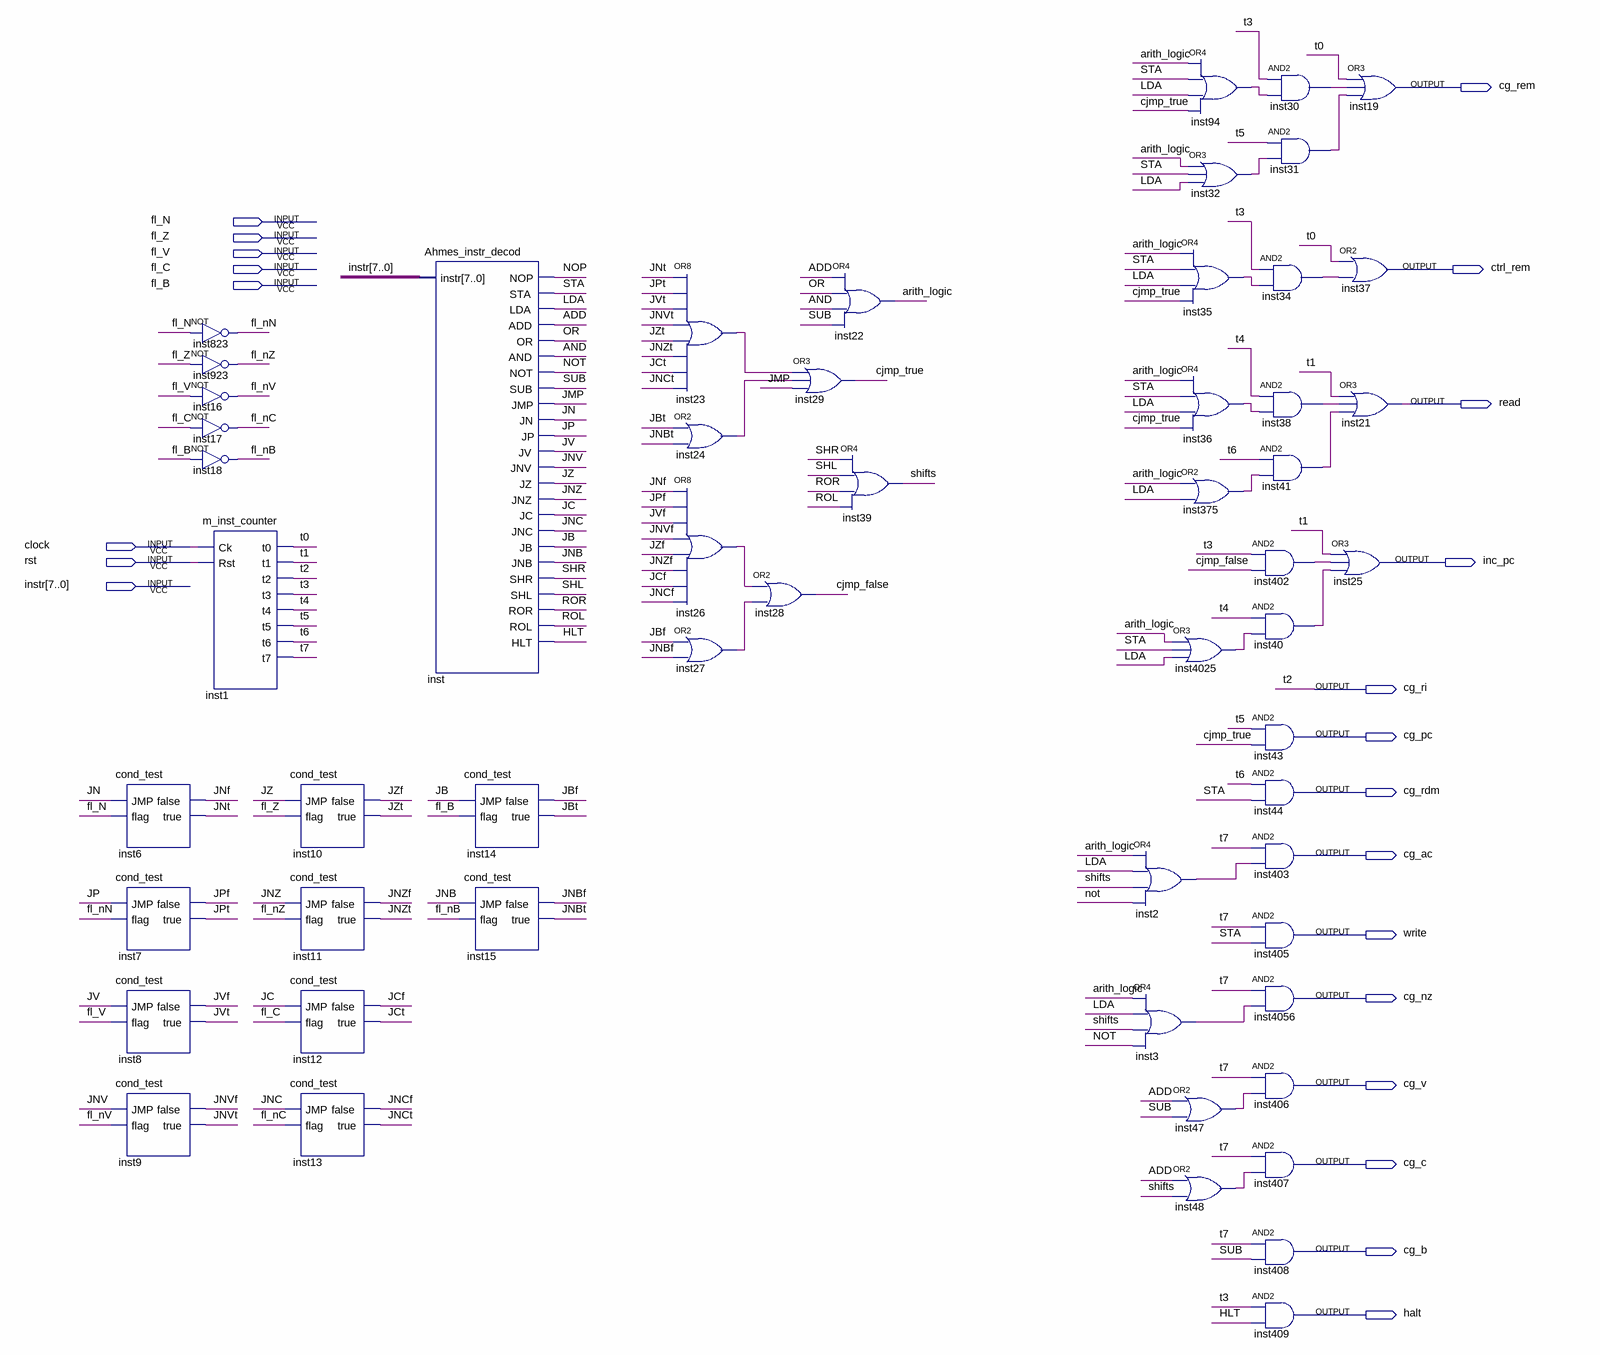
[diagram p0: schematic sheet]
// Quartus schematic Ahmes_uc.bdf as structural Verilog: 55 symbols, 22 pins
module Ahmes_uc (
  input  fl_N,
  input  fl_Z,
  input  fl_V,
  input  fl_C,
  input  fl_B,
  input  clock,
  input  rst,
  input  [7:0] instr,
  output cg_rem,
  output ctrl_rem,
  output read,
  output inc_pc,
  output cg_ri,
  output cg_pc,
  output cg_rdm,
  output cg_ac,
  output write,
  output cg_nz,
  output cg_v,
  output cg_c,
  output cg_b,
  output halt
);

  wire ADD, AND, arith_logic, cjmp_false, cjmp_true, fl_nB, fl_nC, fl_nN, fl_nV, fl_nZ, HLT, inst2_out,
       inst3_out, inst23_out, inst24_out, inst26_out, inst27_out, inst30_out, inst31_out, inst32_out,
       inst34_out, inst35_out, inst36_out, inst38_out, inst40_out, inst41_out, inst47_out, inst48_out,
       inst94_out, inst375_out, inst402_out, inst4025_out, JB, JBf, JBt, JC, JCf, JCt, JMP, JN, JNB, JNBf,
       JNBt, JNC, JNCf, JNCt, JNf, JNt, JNV, JNVf, JNVt, JNZ, JNZf, JNZt, JP, JPf, JPt, JV, JVf, JVt, JZ,
       JZf, JZt, LDA, NOP, NOT, OR, ROL, ROR, shifts, SHL, SHR, STA, SUB, t0, t1, t3, t4, t5, t6, t7;

  cond_test inst6 (.JMP(JN), .flag(fl_N), .false(JNf), .true(JNt));
  cond_test inst7 (.JMP(JP), .flag(fl_nN), .false(JPf), .true(JPt));
  cond_test inst8 (.JMP(JV), .flag(fl_V), .false(JVf), .true(JVt));
  cond_test inst9 (.JMP(JNV), .flag(fl_nV), .false(JNVf), .true(JNVt));
  not inst823 (fl_nN, fl_N);
  not inst923 (fl_nZ, fl_Z);
  not inst16 (fl_nV, fl_V);
  not inst17 (fl_nC, fl_C);
  not inst18 (fl_nB, fl_B);
  m_inst_counter inst1 (
    .Ck(clock), .Rst(rst), .t0(t0), .t1(t1), .t2(cg_ri), .t3(t3), .t4(t4), .t5(t5), .t6(t6), .t7(t7));
  cond_test inst10 (.JMP(JZ), .flag(fl_Z), .false(JZf), .true(JZt));
  cond_test inst11 (.JMP(JNZ), .flag(fl_nZ), .false(JNZf), .true(JNZt));
  cond_test inst12 (.JMP(JC), .flag(fl_C), .false(JCf), .true(JCt));
  cond_test inst13 (.JMP(JNC), .flag(fl_nC), .false(JNCf), .true(JNCt));
  Ahmes_instr_decod inst (
    .instr(instr), .NOP(NOP), .STA(STA), .LDA(LDA), .ADD(ADD), .OR(OR), .AND(AND), .NOT(NOT), .SUB(SUB),
    .JMP(JMP), .JN(JN), .JP(JP), .JV(JV), .JNV(JNV), .JZ(JZ), .JNZ(JNZ), .JC(JC), .JNC(JNC), .JB(JB),
    .JNB(JNB), .SHR(SHR), .SHL(SHL), .ROR(ROR), .ROL(ROL), .HLT(HLT));
  cond_test inst14 (.JMP(JB), .flag(fl_B), .false(JBf), .true(JBt));
  cond_test inst15 (.JMP(JNB), .flag(fl_nB), .false(JNBf), .true(JNBt));
  or inst23 (inst23_out, JNt, JPt, JVt, JNVt, JZt, JNZt, JCt, JNCt);
  or inst24 (inst24_out, JBt, JNBt);
  or inst26 (inst26_out, JNf, JPf, JVf, JNVf, JZf, JNZf, JCf, JNCf);
  or inst27 (inst27_out, JBf, JNBf);
  or inst28 (cjmp_false, inst26_out, inst27_out);
  or inst22 (arith_logic, ADD, OR, AND, SUB);
  or inst29 (cjmp_true, inst23_out, inst24_out, JMP);
  or inst39 (shifts, SHR, SHL, ROR, ROL);
  or inst2 (inst2_out, arith_logic, LDA, shifts, NOT);
  or inst3 (inst3_out, arith_logic, LDA, shifts, NOT);
  or inst94 (inst94_out, arith_logic, STA, LDA, cjmp_true);
  or inst32 (inst32_out, arith_logic, STA, LDA);
  or inst35 (inst35_out, arith_logic, STA, LDA, cjmp_true);
  or inst36 (inst36_out, arith_logic, STA, LDA, cjmp_true);
  or inst375 (inst375_out, arith_logic, LDA);
  or inst4025 (inst4025_out, arith_logic, STA, LDA);
  or inst47 (inst47_out, ADD, SUB);
  or inst48 (inst48_out, ADD, shifts);
  and inst30 (inst30_out, t3, inst94_out);
  and inst31 (inst31_out, t5, inst32_out);
  and inst34 (inst34_out, t3, inst35_out);
  and inst38 (inst38_out, t4, inst36_out);
  and inst41 (inst41_out, t6, inst375_out);
  and inst402 (inst402_out, t3, cjmp_false);
  and inst40 (inst40_out, t4, inst4025_out);
  and inst43 (cg_pc, t5, cjmp_true);
  and inst44 (cg_rdm, t6, STA);
  and inst403 (cg_ac, t7, inst2_out);
  and inst405 (write, t7, STA);
  and inst4056 (cg_nz, t7, inst3_out);
  and inst406 (cg_v, t7, inst47_out);
  and inst407 (cg_c, t7, inst48_out);
  and inst408 (cg_b, t7, SUB);
  and inst409 (halt, t3, HLT);
  or inst19 (cg_rem, t0, inst30_out, inst31_out);
  or inst37 (ctrl_rem, t0, inst34_out);
  or inst21 (read, t1, inst38_out, inst41_out);
  or inst25 (inc_pc, t1, inst402_out, inst40_out);

  // Other names for the same wires on the sheet: t2 = cg_ri
endmodule
